# EAGLE design M785 (EAGLE 6.6.0)
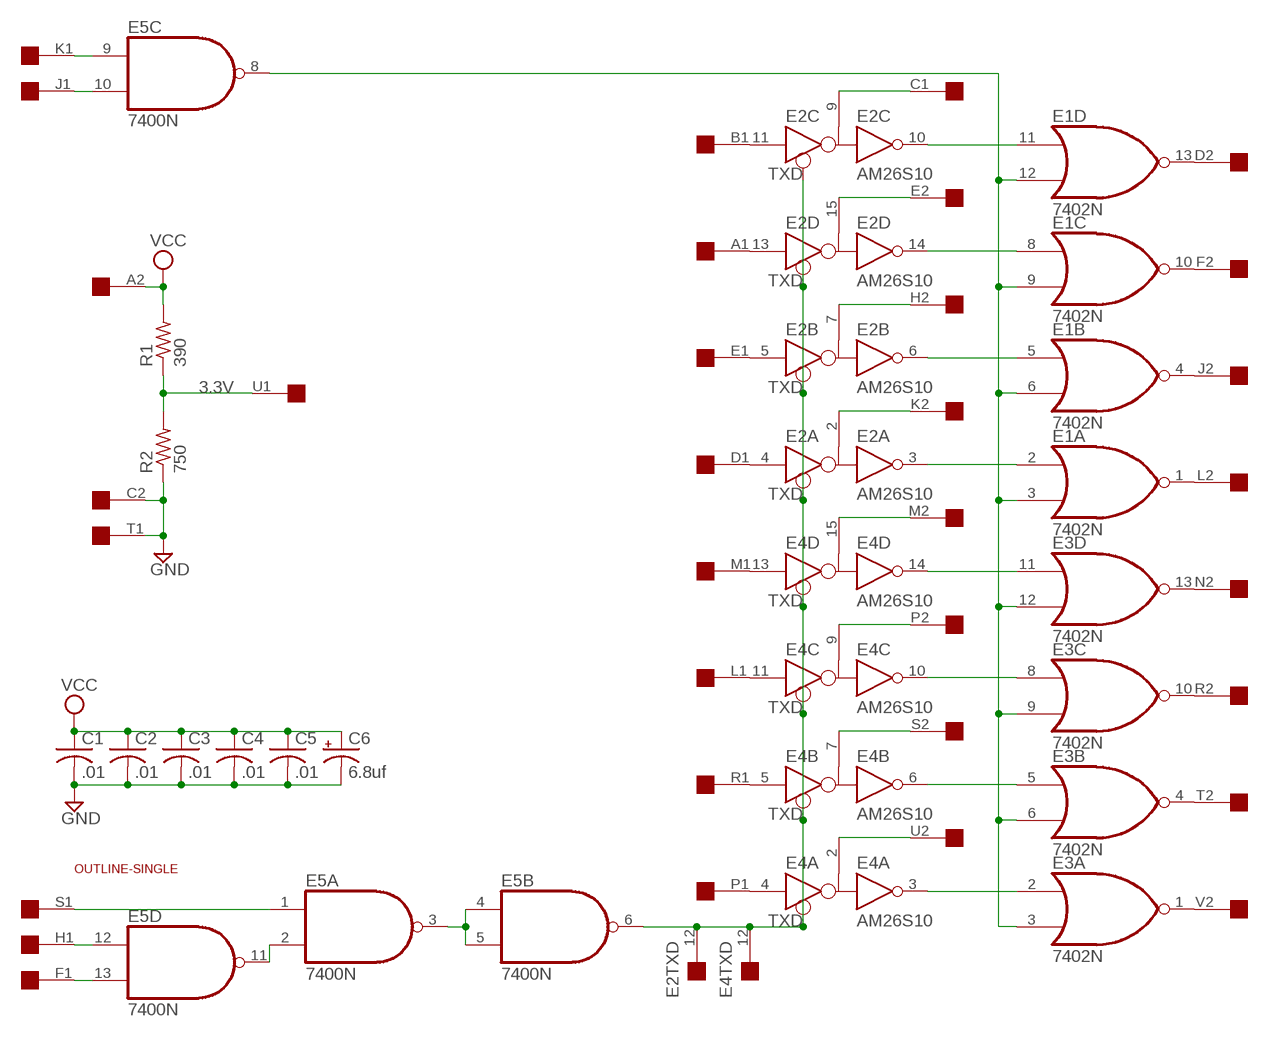
[diagram p0: schematic, sheet 1]

## Parts
C1  .01  C-US050-025X075  [C050-025X075]
C2  .01  C-US050-025X075  [C050-025X075]
C3  .01  C-US050-025X075  [C050-025X075]
C4  .01  C-US050-025X075  [C050-025X075]
C5  .01  C-US050-025X075  [C050-025X075]
C6  6.8uf  CPOL-USE15-5AXIAL  [E15-5]
E1  7402N  [DIL14]
E2  AM26S10  [DIL16]
E3  7402N  [DIL14]
E4  AM26S10  [DIL16]
E5  7400N  [DIL14]
R1  390  R-US_0207/10  [0207/10]
R2  750  R-US_0207/10  [0207/10]
U$1  SINGLE  [EDGE-CON2]
U$2  OUTLINE-SINGLE  [SINGLE]

## Nets
3.3V: R1.1 R2.2 U$1.U1
GND: C1.2 C2.2 C3.2 C4.2 C5.2 C6.- R2.1 U$1.C2 U$1.T1
N$2: E2.12(TXD:TXD) E4.12(TXD:TXD) E5.6(B:O)
N$3: E4.15(D:B) U$1.M2
N$4: E4.9(C:B) U$1.P2
N$5: E4.13(D:D) U$1.M1
N$6: E4.11(C:D) U$1.L1
N$7: E4.7(B:B) U$1.S2
N$8: E4.5(B:D) U$1.R1
N$9: E4.2(A:B) U$1.U2
N$10: E4.4(A:D) U$1.P1
N$11: E2.9(C:B) U$1.C1
N$12: E2.11(C:D) U$1.B1
N$13: E2.15(D:B) U$1.E2
N$14: E2.13(D:D) U$1.A1
N$15: E2.7(B:B) U$1.H2
N$16: E2.5(B:D) U$1.E1
N$17: E2.2(A:B) U$1.K2
N$18: E2.4(A:D) U$1.D1
N$19: E5.9(C:I0) U$1.K1
N$20: E5.10(C:I1) U$1.J1
N$21: E1.13(D:O) U$1.D2
N$22: E1.10(C:O) U$1.F2
N$23: E1.4(B:O) U$1.J2
N$24: E1.1(A:O) U$1.L2
N$25: E3.13(D:O) U$1.N2
N$26: E3.10(C:O) U$1.R2
N$27: E3.4(B:O) U$1.T2
N$28: E3.1(A:O) U$1.V2
N$29: E5.1(A:I0) U$1.S1
N$30: E5.2(A:I1) E5.11(D:O)
N$31: E5.12(D:I0) U$1.H1
N$32: E5.13(D:I1) U$1.F1
N$33: E1.3(A:I1) E1.6(B:I1) E1.9(C:I1) E1.12(D:I1) E3.3(A:I1) E3.6(B:I1) E3.9(C:I1) E3.12(D:I1) E5.8(C:O)
N$34: E3.2(A:I0) E4.3(A:R)
N$35: E3.5(B:I0) E4.6(B:R)
N$36: E3.8(C:I0) E4.10(C:R)
N$37: E3.11(D:I0) E4.14(D:R)
N$38: E1.2(A:I0) E2.3(A:R)
N$39: E1.5(B:I0) E2.6(B:R)
N$40: E1.8(C:I0) E2.14(D:R)
N$41: E1.11(D:I0) E2.10(C:R)
N$42: E5.3(A:O) E5.4(B:I0) E5.5(B:I1)
VCC: C1.1 C2.1 C3.1 C4.1 C5.1 C6.+ R1.2 U$1.A2
Unconnected: U$1.B2 U$1.N1 U$1.V1

## Power pins joined to a net without a drawn wire
GND: E1.7(P:GND) E2.1(GND:GND) E2.8(PWR:GND) E3.7(P:GND) E4.1(GND:GND) E4.8(PWR:GND) E5.7(P:GND)
VCC: E1.14(P:VCC) E2.16(PWR:VCC) E3.14(P:VCC) E4.16(PWR:VCC) E5.14(P:VCC)

## Library data of the parts
C1-C5 = rcl:C-US: CAPACITOR, American symbol
C6 = rcl:CPOL-US: POLARIZED CAPACITOR, American symbol
E1 E3 = 74xx-us:74*02: Quad 2-input NOR gate
E2 E4 = dec-con:AM26S10: Bus Transceiver
E5 = 74xx-us:74*00: Quad 2-input NAND gate
R1 R2 = rcl:R-US_: RESISTOR, American symbol
U$1 = dec-con:SINGLE: Single-Height DEC board
U$2 = dec-con:OUTLINE-*: Board outlines for DEC boards.

## Board
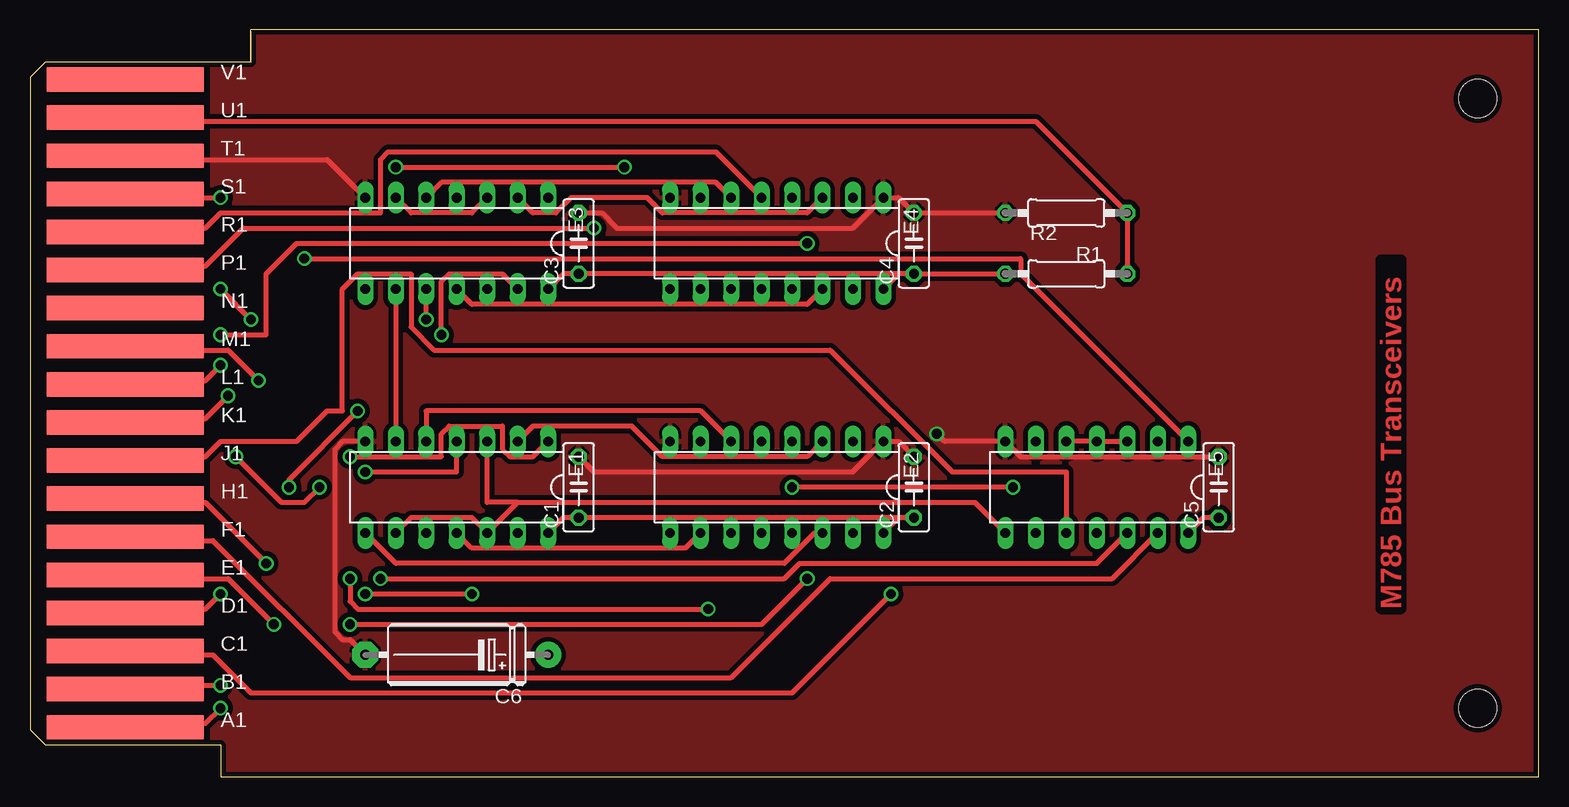
[diagram p1: board, top side]
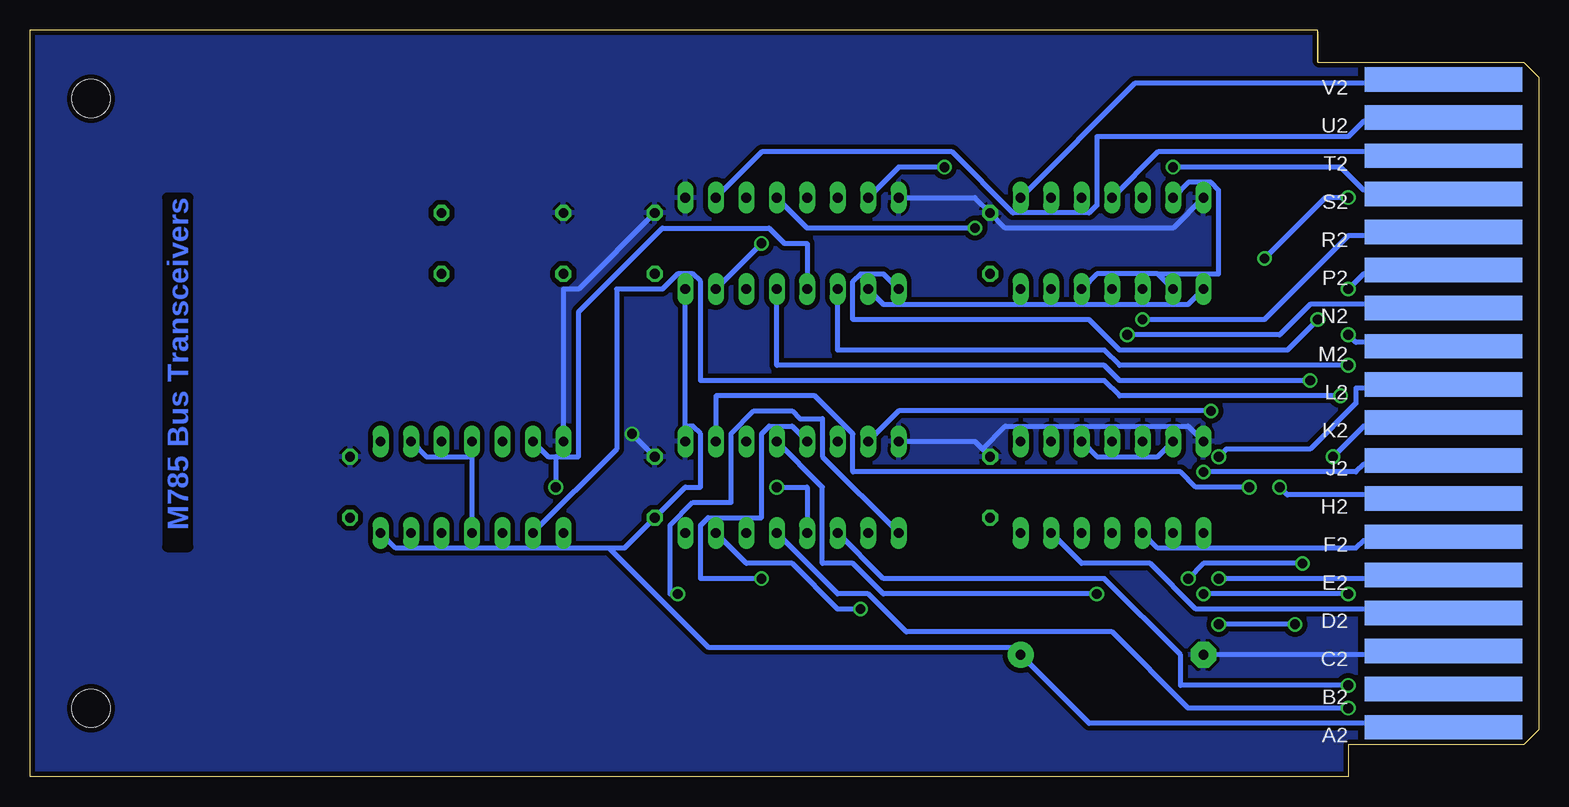
[diagram p2: board, bottom side, seen from below]

Size 125.73 x 62.23 mm. Coordinates in mm from the lower left corner, seen from the top.
Copper layers (1+16): Top 0.035mm / dielectric 1.5mm / Bottom 0.035mm
Design rules "16mils": minimum track width 16mil, minimum drill 32mil, track to track 15mil, track to pad 10mil, pad to pad 10mil, via to via 10mil, smd to smd 10mil, copper to edge 13mil, drill to drill 10mil, minimum pad ring 10mil, minimum via ring 8mil, stop-mask expansion 0mil, vias tented up to drill 0mil, thermal gap 10mil

### Footprints (pad centres in the part's own frame; a part is rotated, then mirrored left to right if it is on the bottom)
C050-025X075 = drill 0.813 octagon: 1 -2.54,0; 2 2.54,0
E15-5 = drill 0.813 pad 2.159: + -7.62,0 | drill 0.813 pad 2.159 octagon: - 7.62,0
DIL14 = drill 0.813 long: 1 -7.62,-3.81; 2 -5.08,-3.81; 3 -2.54,-3.81; 4 0,-3.81; 5 2.54,-3.81; 6 5.08,-3.81; 7 7.62,-3.81; 8 7.62,3.81; 9 5.08,3.81; 10 2.54,3.81; 11 0,3.81; 12 -2.54,3.81; 13 -5.08,3.81; 14 -7.62,3.81
DIL16 = drill 0.813 long: 1 -8.89,-3.81; 2 -6.35,-3.81; 3 -3.81,-3.81; 4 -1.27,-3.81; 5 1.27,-3.81; 6 3.81,-3.81; 7 6.35,-3.81; 8 8.89,-3.81; 9 8.89,3.81; 10 6.35,3.81; 11 3.81,3.81; 12 1.27,3.81; 13 -1.27,3.81; 14 -3.81,3.81; 15 -6.35,3.81; 16 -8.89,3.81
0207/10 = drill 0.813 octagon: 1 -5.08,0; 2 5.08,0
EDGE-CON2 = smd 13.106 x 2.032: A1 7.938,4.128; B1 7.938,7.303; C1 7.938,10.477; D1 7.938,13.652; E1 7.938,16.828; F1 7.938,20.003; H1 7.938,23.177; J1 7.938,26.352; K1 7.938,29.527; L1 7.938,32.703; M1 7.938,35.877; N1 7.938,39.053; P1 7.938,42.227; R1 7.938,45.403; S1 7.938,48.578; T1 7.938,51.752; U1 7.938,54.928; V1 7.938,58.102 | smd 13.106 x 2.032 bottom: A2 7.938,4.128; B2 7.938,7.303; C2 7.938,10.477; D2 7.938,13.652; E2 7.938,16.828; F2 7.938,20.003; H2 7.938,23.177; J2 7.938,26.352; K2 7.938,29.527; L2 7.938,32.703; M2 7.938,35.877; N2 7.938,39.053; P2 7.938,42.227; R2 7.938,45.403; S2 7.938,48.578; T2 7.938,51.752; U2 7.938,54.928; V2 7.938,58.102
SINGLE = hole 3.175: 120.65,56.515; 120.65,5.715

### Placement (x,y rotation side)
C1  45.72,24.13 90 top
C2  73.66,24.13 90 top
C3  45.72,44.45 90 top
C4  73.66,44.45 90 top
C5  99.06,24.13 90 top
C6  35.56,10.16 180 top
E1  35.56,24.13 180 top
E2  62.23,24.13 180 top
E3  35.56,44.45 180 top
E4  62.23,44.45 180 top
E5  88.9,24.13 180 top
R1  86.36,41.91 180 top
R2  86.36,46.99 0 top
U$1  0,0 0 top
U$2  0,0 0 top

### Tracks (layer width: path | path; a pad name or v marks a point on that pad's centre or on a via)
3.3V
  Top 0.406: R1.1 R2.2 83.82,54.61 8.26,54.61 U$1.U1
GND  (via drill 0.81)
  Top 0.406: C2.2 72.39,27.94 E2.1 68.58,25.4 46.99,25.4 C1.2 | C6.- 26.67,11.43 26.04,11.43 25.4,12.06 25.4,27.3 26.04,27.94 E1.7 | C5.2 82.55,26.67 E5.7 76.2,27.94 v75.57,28.57 | R2.1 C4.2 72.39,48.26 E4.1 68.58,45.72 48.9,45.72 47.63,46.99 C3.2 | E3.7 24.77,51.44 8.26,51.44 U$1.T1
  Bottom 0.406: C6.- 8.26,10.16 U$1.C2 | 46.36,27.3 46.99,27.94 E2.8 | 46.36,27.3 C1.2 | E1.7 29.21,29.21 44.45,29.21 46.36,27.3 | E4.8 46.99,48.26 C3.2 44.45,45.72 30.48,45.72 E3.7 | E5.7 81.28,40.64 80.01,40.64 C4.2 | v75.57,28.57 C2.2
  pour Top (isolate 0.406): 15.24,62.23 125.73,62.23 125.73,0 15.24,0
  pour Bottom (isolate 0.406): 15.24,62.23 125.73,62.23 125.73,0 15.24,0
N$2  (via drill 0.81)
  Top 0.406: v81.92,24.13 v63.5,24.13
  Bottom 0.406: E2.12 60.96,24.13 v63.5,24.13 | 81.92,26.67 v81.92,24.13 | 81.92,26.67 82.55,26.67 E5.6 | E4.12 60.96,44.45 62.87,44.45 64.14,45.72 73.03,45.72 80.01,38.73 80.01,26.67 81.92,26.67
N$3  (via drill 0.81)
  Top 0.406: v64.77,44.45 22.23,44.45 19.69,41.91 19.69,36.83 v15.88,36.83
  Bottom 0.406: v64.77,44.45 E4.15 | v15.88,36.83 15.24,36.2 8.26,36.2 U$1.M2
N$4  (via drill 0.81)
  Top 0.406: v15.88,40.64 v18.42,38.1
  Bottom 0.406: E4.9 54.61,41.91 56.52,41.91 57.15,41.27 57.15,38.1 37.47,38.1 34.93,35.56 20.96,35.56 v18.42,38.1 | v15.88,40.64 14.61,41.91 8.26,41.91 U$1.P2
N$5  (via drill 0.81)
  Top 0.406: v19.05,33.02 16.51,35.56 8.26,35.56 U$1.M1
  Bottom 0.406: E4.13 63.5,34.29 36.2,34.29 34.93,33.02 v19.05,33.02
N$6  (via drill 0.81)
  Top 0.406: v15.88,34.29 14.61,33.02 8.26,33.02 U$1.L1
  Bottom 0.406: E4.11 58.42,35.56 36.2,35.56 34.93,34.29 v15.88,34.29
N$7  (via drill 0.81)
  Top 0.406: v30.48,50.8 v49.53,50.8
  Bottom 0.406: E4.7 53.34,50.8 v49.53,50.8 | v30.48,50.8 16.51,50.8 14.61,48.9 8.26,48.9 U$1.S2
N$8
  Top 0.406: E4.5 57.15,52.07 29.85,52.07 29.21,51.44 29.21,46.99 15.88,46.99 14.61,45.72 8.26,45.72 U$1.R1
N$9
  Bottom 0.406: E4.2 64.77,52.07 48.9,52.07 43.82,46.99 37.47,46.99 36.83,47.62 36.83,53.34 15.88,53.34 14.61,54.61 8.26,54.61 U$1.U2
N$10  (via drill 0.81)
  Top 0.406: v46.99,45.72 17.78,45.72 14.61,42.55 8.26,42.55 U$1.P1
  Bottom 0.406: E4.4 60.96,45.72 v46.99,45.72
N$11  (via drill 0.81)
  Top 0.406: v71.76,15.24 63.5,6.99 18.42,6.99 15.24,10.16 8.26,10.16 U$1.C1
  Bottom 0.406: E2.9 59.69,26.67 59.69,29.84 61.6,29.84 62.23,30.48 65.41,30.48 67.31,28.57 67.31,22.86 70.49,22.86 72.39,20.95 72.39,15.24 v71.76,15.24
N$12  (via drill 0.81)
  Top 0.406: v15.88,7.62 8.26,7.62 U$1.B1
  Bottom 0.406: E2.11 54.61,16.51 36.2,16.51 29.85,10.16 29.85,7.62 v15.88,7.62
N$13  (via drill 0.81)
  Top 0.406: v56.52,13.97 27.31,13.97 26.67,14.61 v26.67,16.51
  Bottom 0.406: E2.15 66.04,17.78 62.23,17.78 58.42,13.97 v56.52,13.97 | v26.67,16.51 8.26,16.51 U$1.E2
N$14  (via drill 0.81)
  Top 0.406: v15.88,5.71 14.61,4.45 8.26,4.45 U$1.A1
  Bottom 0.406: E2.13 58.42,15.24 55.88,15.24 52.71,12.06 35.56,12.06 29.21,5.71 v15.88,5.71
N$15  (via drill 0.81)
  Top 0.406: v27.31,30.48 21.59,24.77 v21.59,24.13
  Bottom 0.406: E2.7 53.34,30.48 v27.31,30.48 | v21.59,24.13 20.96,23.5 8.26,23.5 U$1.H2
N$16  (via drill 0.81)
  Top 0.406: v64.77,16.51 60.96,12.7 v26.67,12.7 | v20.32,12.7 16.51,16.51 8.26,16.51 U$1.E1
  Bottom 0.406: E2.5 62.23,29.21 64.14,29.21 64.77,28.57 64.77,21.59 69.22,21.59 69.85,20.95 69.85,16.51 v64.77,16.51 | v20.32,12.7 v26.67,12.7
N$17  (via drill 0.81)
  Top 0.406: v24.13,24.13 22.86,22.86 20.96,22.86 v17.15,26.67
  Bottom 0.406: E2.2 68.58,31.75 60.33,31.75 57.15,28.57 57.15,25.4 29.85,25.4 28.58,24.13 v24.13,24.13 | v17.15,26.67 14.61,29.21 8.26,29.21 U$1.K2
N$18  (via drill 0.81)
  Top 0.406: v27.94,15.24 v36.83,15.24 | v15.88,15.24 14.61,13.97 8.26,13.97 U$1.D1
  Bottom 0.406: E2.4 59.69,24.13 59.69,17.78 57.15,17.78 54.61,15.24 v36.83,15.24 | v15.88,15.24 v27.94,15.24
N$19  (via drill 0.81)
  Top 0.406: v16.51,31.75 14.61,29.84 8.26,29.84 U$1.K1
  Bottom 0.406: E5.9 76.84,27.3 76.84,40.64 73.03,40.64 71.76,41.91 70.49,41.91 69.85,41.27 69.85,33.02 36.2,33.02 34.93,31.75 v16.51,31.75
N$20
  Top 0.406: E5.10 86.36,25.4 76.84,25.4 66.68,35.56 33.66,35.56 31.75,37.47 31.75,41.91 27.31,41.91 26.04,40.64 26.04,30.48 24.77,30.48 22.23,27.94 15.88,27.94 14.61,26.67 8.26,26.67 U$1.J1
N$21
  Bottom 0.406: E1.13 38.1,17.78 32.39,17.78 28.58,13.97 8.26,13.97 U$1.D2
N$22
  Bottom 0.406: E1.10 31.75,19.05 15.24,19.05 14.61,19.68 8.26,19.68 U$1.F2
N$23  (via drill 0.81)
  Top 0.406: E1.4 35.56,25.4 v27.94,25.4
  Bottom 0.406: v27.94,25.4 15.24,25.4 14.61,26.04 8.26,26.04 U$1.J2
N$24  (via drill 0.81)
  Top 0.406: E1.1 41.91,26.67 40.01,26.67 39.37,27.3 39.37,29.21 34.93,29.21 34.29,28.57 34.29,26.67 v26.67,26.67
  Bottom 0.406: v26.67,26.67 26.04,27.3 19.05,27.3 15.24,31.11 15.24,32.38 8.26,32.38 U$1.L2
N$25  (via drill 0.81)
  Top 0.406: E3.13 39.37,41.91 34.93,41.91 34.29,41.27 v34.29,36.83
  Bottom 0.406: v34.29,36.83 21.59,36.83 19.05,39.37 8.26,39.37 U$1.N2
N$26  (via drill 0.81)
  Top 0.406: v33.02,38.1 E3.10
  Bottom 0.406: v33.02,38.1 22.86,38.1 15.88,45.09 8.26,45.09 U$1.R2
N$27
  Bottom 0.406: E3.4 31.75,52.07 8.26,52.07 U$1.T2
N$28
  Bottom 0.406: E3.1 33.66,57.78 8.26,57.78 U$1.V2
N$29  (via drill 0.81)
  Top 0.406: E5.1 82.55,41.91 82.55,43.18 v22.86,43.18 | v15.88,48.26 8.26,48.26 U$1.S1
  Bottom 0.406: v22.86,43.18 17.78,48.26 v15.88,48.26
N$30
  Bottom 0.406: E5.11 88.9,26.67 92.71,26.67 E5.2
N$31  (via drill 0.81)
  Top 0.406: E5.12 88.9,17.78 64.14,17.78 62.87,16.51 v29.21,16.51 | v19.69,17.78 14.61,22.86 8.26,22.86 U$1.H1
  Bottom 0.406: v29.21,16.51 27.94,17.78 v19.69,17.78
N$32
  Top 0.406: E5.13 90.17,16.51 66.68,16.51 58.42,8.26 26.67,8.26 15.24,19.68 8.26,19.68 U$1.F1
N$33
  Top 0.406: E3.6 31.75,46.99 36.83,46.99 E3.3 | E3.9 E1.6 | E1.9 31.75,21.59 36.83,21.59 E1.12 40.64,22.86 | E5.8 78.74,22.86 40.64,22.86 | E1.3 38.1,22.86 40.64,22.86
  Bottom 0.406: E3.12 36.83,41.91 31.75,41.91 | E3.9 31.75,41.91 | E3.6 29.21,49.53 27.31,49.53 26.67,48.9 26.67,41.91 31.75,41.91 | E1.6 31.75,26.67 36.83,26.67 E1.3
N$34
  Top 0.406: E3.2 41.91,46.99 43.82,46.99 45.09,48.26 51.44,48.26 52.71,46.99 64.77,46.99 E4.3
N$35
  Top 0.406: E3.5 34.29,49.53 57.15,49.53 E4.6
N$36
  Bottom 0.406: E3.8 29.21,39.37 54.61,39.37 E4.10
N$37
  Top 0.406: E3.11 36.83,39.37 64.77,39.37 E4.14
N$38
  Top 0.406: E1.2 41.91,29.21 50.17,29.21 52.71,26.67 64.77,26.67 E2.3
N$39
  Top 0.406: E1.5 33.02,30.48 55.88,30.48 E2.6
N$40
  Top 0.406: E1.8 30.48,17.78 62.87,17.78 65.41,20.32 E2.14
N$41
  Top 0.406: E1.11 36.83,19.05 54.61,19.05 E2.10
N$42
  Top 0.406: E5.5 E5.4 E5.3
VCC
  Top 0.406: E3.14 44.45,41.91 C3.1 72.39,41.91 | 72.39,41.91 E4.16 | 72.39,41.91 C4.1 R1.2 | E5.14 97.79,21.59 C5.1 | E1.14 44.45,21.59 C1.1 72.39,21.59 | 72.39,21.59 E2.16 | C2.1 72.39,21.59
  Bottom 0.406: U$1.A2 8.26,4.45 37.47,4.45 C6.+ 43.82,10.79 69.22,10.79 77.47,19.05 | E5.14 95.25,19.05 77.47,19.05 | 77.47,19.05 76.2,19.05 C2.1 71.12,24.13 69.85,24.13 69.85,28.57 70.49,29.21 71.12,29.21 E4.16

### Text on the board
Top: M785 Bus Transceivers
Bottom: M785 Bus Transceivers